# EAGLE schematic LSM303D (EAGLE 7.1.0)
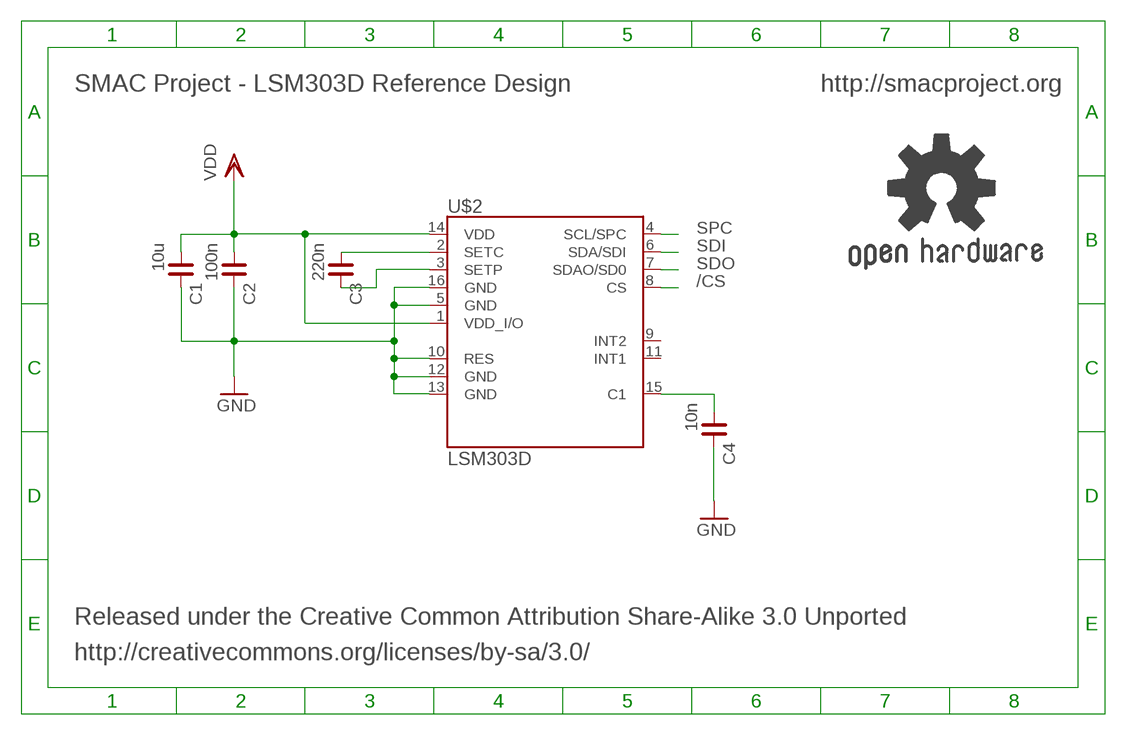
[diagram p0: schematic, sheet 1]

## Parts
C1  10u  C_0402  [C0402]
C2  100n  C_0402  [C0402]
C3  220n  C_0402  [C0402]
C4  10n  C_0402  [C0402]
GOLD_ORB_SM2  OSHWLOGO_REF_SM  [OSHW2REF]
U$2  LSM303D  [LGA16-3MM]

## Nets
/CS: U$2.8(CS)
GND: C1.2 C2.2 C4.2 U$2.5(GND) U$2.10(RES) U$2.12(GND) U$2.13(GND) U$2.16(GND)
N$2: C3.1 U$2.2(SETC)
N$10: C4.1 U$2.15(C1)
N$11: C3.2 U$2.3(SETP)
SDI: U$2.6(SDA/SDI)
SDO: U$2.7(SDAO/SD0)
SPC: U$2.4(SCL/SPC)
VDD: C1.1 C2.1 U$2.1(VDD_I/O) U$2.14(VDD)
Unconnected: U$2.9(INT2) U$2.11(INT1)

## Notes on the sheet
- SMAC Project - LSM303D Reference Design | http://smacproject.org
- Released under the Creative Common Attribution Share-Alike 3.0 Unported
- http://creativecommons.org/licenses/by-sa/3.0/

## Library data of the parts
C1-C4 = rc-master-smd:C_: NON-POLARIZED CAP
GOLD_ORB_SM2 = bfl:OSHWLOGO: These are Open-Source Hardware logos.
U$2 = SparkFun-Sensors:LSM303D